# Altium project Data Receiver.PrjPcb
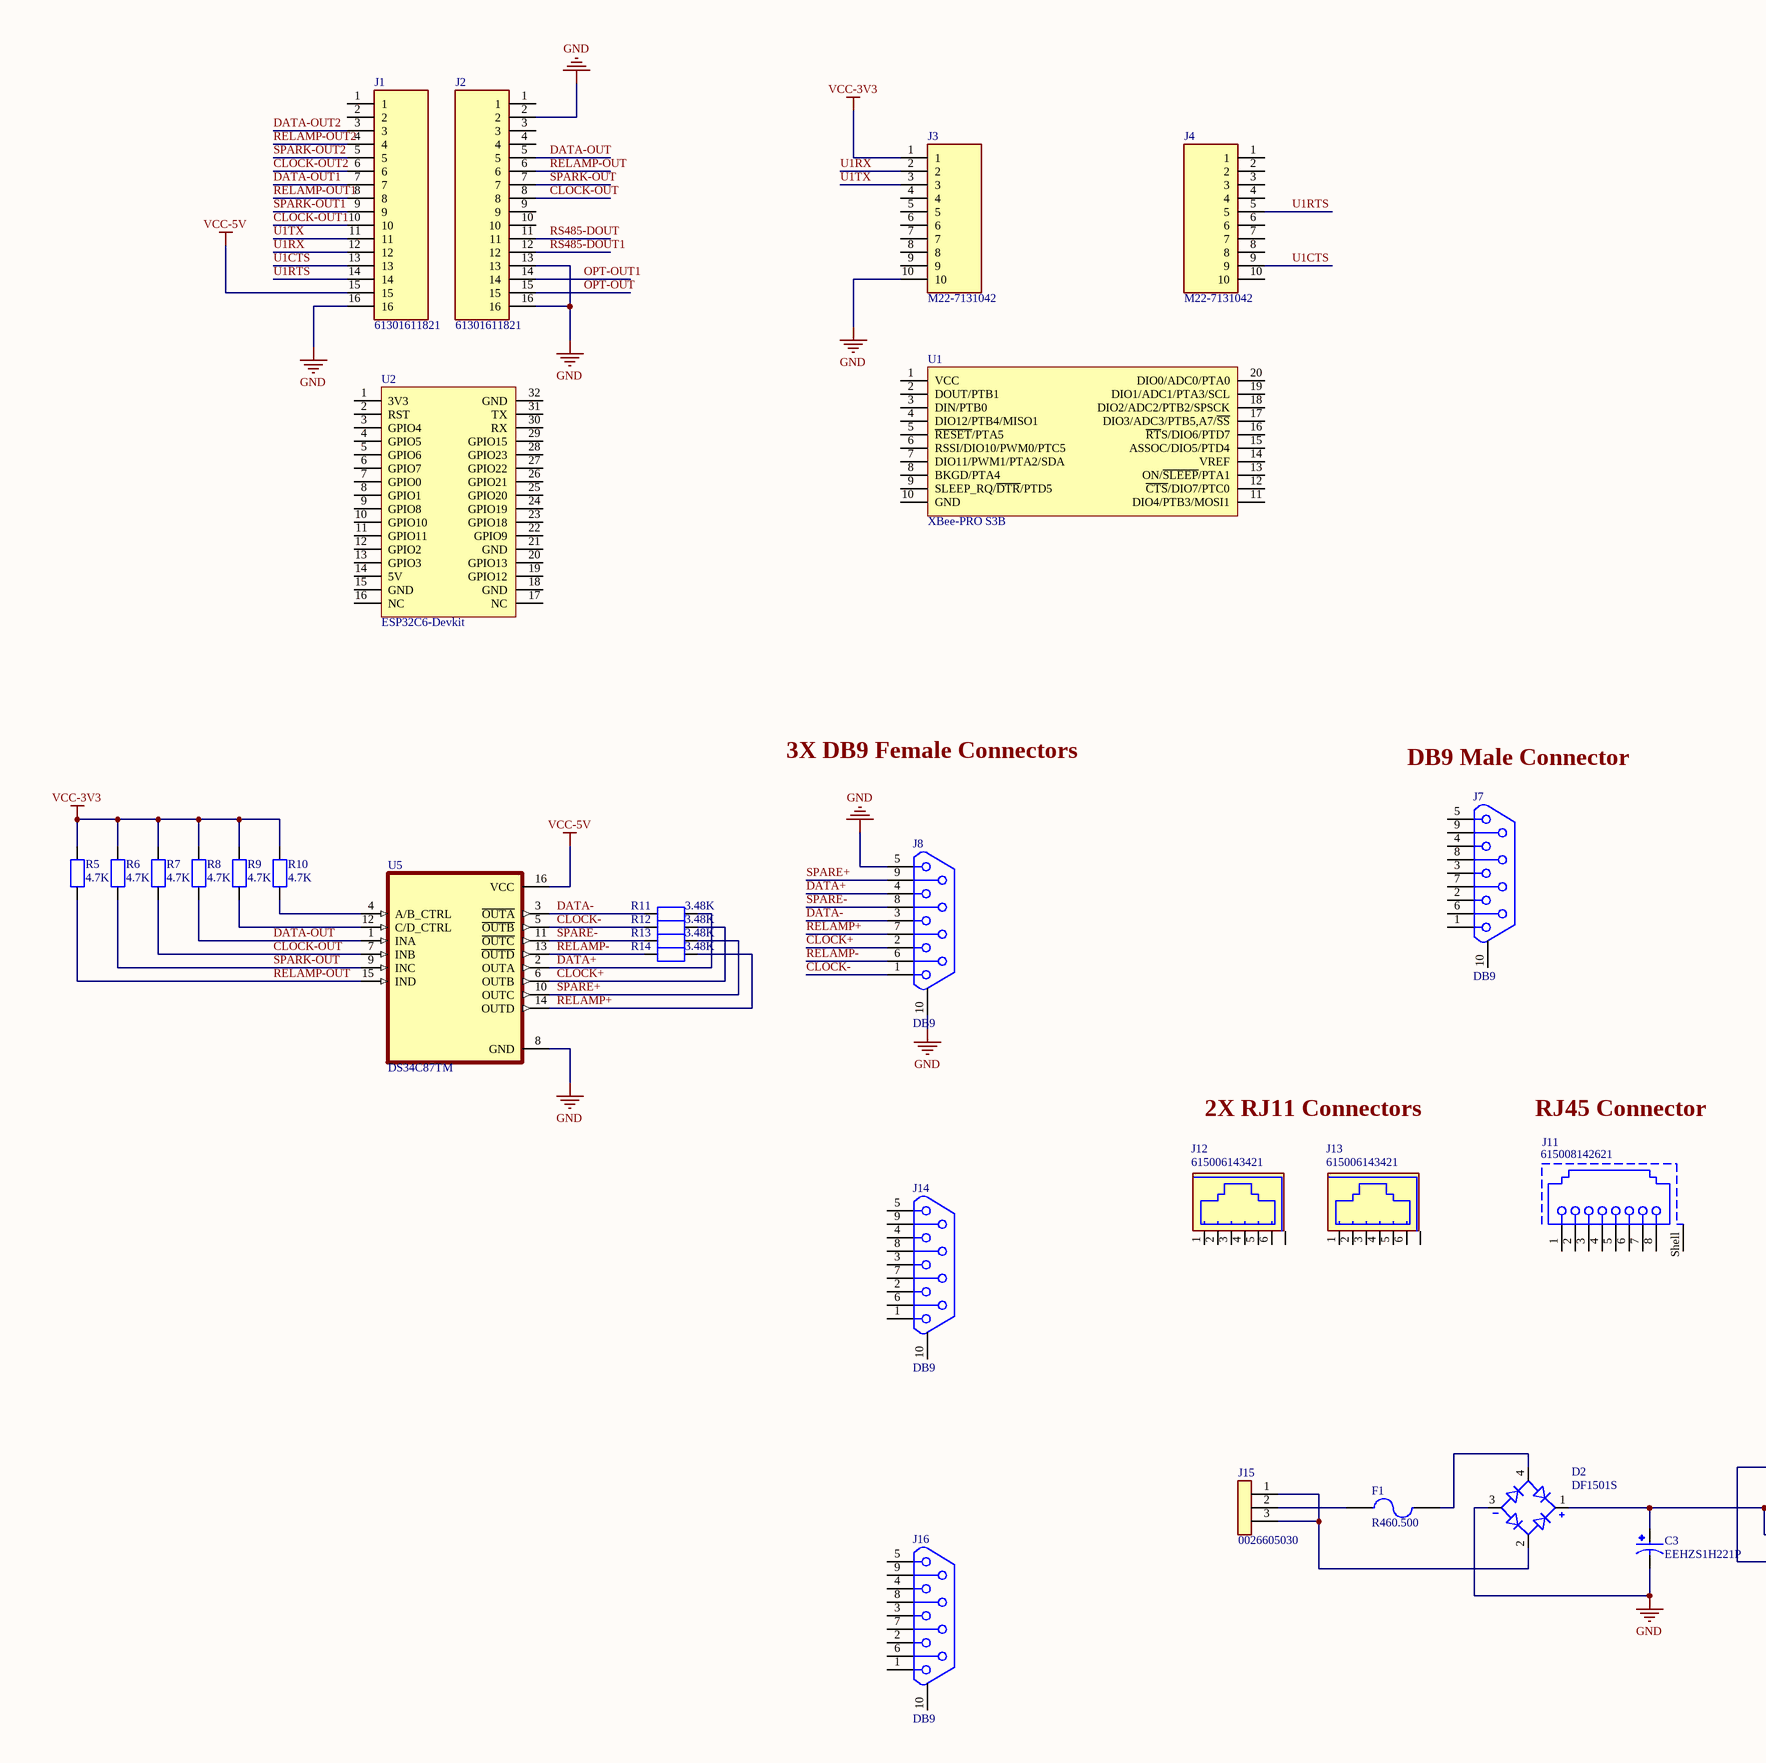
[diagram p0: Data Receiver.SchDoc, left]
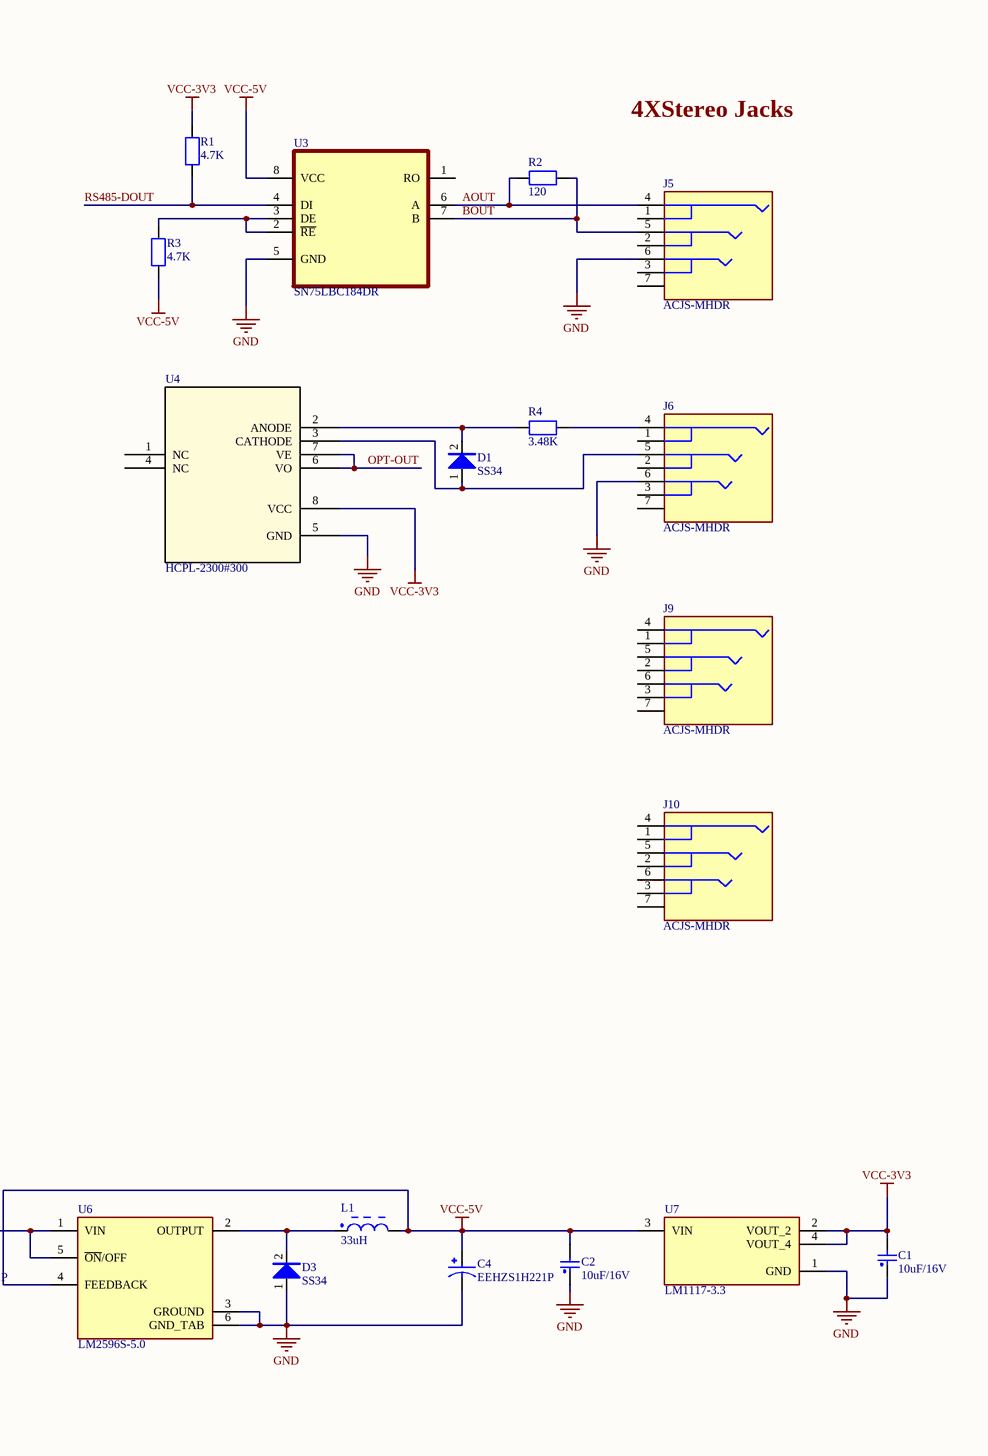
[diagram p1: Data Receiver.SchDoc, right]
1 sheet, 46 parts. Net scope: global (net labels, ports and power ports of the same name join across sheets).
Board file: Data Receiver.PcbDoc

## Sheet Data Receiver.SchDoc
size A2; SheetNumber: 1; SheetTotal: 1

### Parts
C1  10uF/16V  [CAP-0805]
C2  10uF/16V  [CAP-0805]
C3  EEHZS1H221P  [CAP_EEHZS1H221P]
C4  EEHZS1H221P  [CAP_EEHZS1H221P]
D1  SS34  [SMA]
D2  DF1501S  [SOT520P1040X293-4N]
D3  SS34  [SMA]
F1  R460.500  [CAPM7243X30N]
J1  61301611821  [61301611821]
J2  61301611821  [61301611821]
J3  M22-7131042  [M22-7131042]
J4  M22-7131042  [M22-7131042]
J5  ACJS-MHDR  [ACJSMHDR]
J6  ACJS-MHDR  [ACJSMHDR]
J7  DB9  [DB9/F_A]
J8  DB9  [DB9/S_A]
J9  ACJS-MHDR  [ACJSMHDR]
J10  ACJS-MHDR  [ACJSMHDR]
J11  615008142621  [615008142621]
J12  615006143421  [615006143421]
J13  615006143421  [615006143421]
J14  DB9  [DB9/S_A]
J15  0026605030  [0026605030]
J16  DB9  [DB9/S_A]
L1  33uH  [IND_BOURNS_SRR12]
R1  4.7K  [R0603]
R2  120  [R0603]
R3  4.7K  [R0603]
R4  3.48K  [R0603]
R5  4.7K  [R0603]
R6  4.7K  [R0603]
R7  4.7K  [R0603]
R8  4.7K  [R0603]
R9  4.7K  [R0603]
R10  4.7K  [R0603]
R11  3.48K  [R0603]
R12  3.48K  [R0603]
R13  3.48K  [R0603]
R14  3.48K  [R0603]
U1  XBee-PRO S3B  [XBEE(MMS-110-02-L-SV-K-TR)]
U2  ESP32C6-Devkit  [ESP32-C6-Devkit]
U3  SN75LBC184DR  [SOIC127P620X175-8N]
U4  HCPL-2300#300  [SOP254P960X420-8N]
U5  DS34C87TM  [SOIC127P600X175-16N]
U6  LM2596S-5.0  [TO170P1524X483-6N]
U7  LM1117-3.3  [VREG_LM1117MPX-3.3]

### Nets
GND: C1.1 C2.1 C3.2 C4.2 D2.3(NEG) D3.1 J1.16 J2.2 J2.13 J2.16 J3.10 J5.6 J6.6 J8.5 J8.10 U3.5(GND) U4.5(GND) U5.8(GND) U6.3(GROUND) U6.6(GND_TAB) U7.1(GND)
VCC-3V3: C1.2 J3.1 R1.2 R5.2 R6.2 R7.2 R8.2 R9.2 R10.2 U4.8(VCC) U7.2(VOUT_2) U7.4(VOUT_4)
VCC-5V: C2.2 C4.1 J1.15 L1.2 R3.1 U3.8(VCC) U5.16(VCC) U6.4(FEEDBACK) U7.3(VIN)
AOUT: J5.4 R2.2 U3.6(A)
BOUT: J5.5 R2.1 U3.7(B)
CLOCK+: J8.2 R12.2 U5.6(OUTB)
CLOCK-: J8.1 R12.1 U5.5(~{OUTB})
CLOCK-OUT: J2.8 R7.1 U5.7(INB)
CLOCK-OUT1: J1.10
CLOCK-OUT2: J1.6
DATA+: J8.4 R11.2 U5.2(OUTA)
DATA-: J8.3 R11.1 U5.3(~{OUTA})
DATA-OUT: J2.5 R8.1 U5.1(INA)
DATA-OUT1: J1.7
DATA-OUT2: J1.3
OPT-OUT: J2.15 U4.6(VO) U4.7(VE)
OPT-OUT1: J2.14
RELAMP+: J8.7 R14.2 U5.14(OUTD)
RELAMP-: J8.6 R14.1 U5.13(~{OUTD})
RELAMP-OUT: J2.6 R5.1 U5.15(IND)
RELAMP-OUT1: J1.8
RELAMP-OUT2: J1.4
RS485-DOUT: J2.11 R1.1 U3.4(DI)
RS485-DOUT1: J2.12
SPARE+: J8.9 R13.2 U5.10(OUTC)
SPARE-: J8.8 R13.1 U5.11(~{OUTC})
SPARK-OUT: J2.7 R6.1 U5.9(INC)
SPARK-OUT1: J1.9
SPARK-OUT2: J1.5
U1CTS: J1.13 J4.9
U1RTS: J1.14 J4.5
U1RX: J1.12 J3.2
U1TX: J1.11 J3.3
NetC3_1: C3.1 D2.1(POS) U6.1(VIN) U6.5(~{ON}/OFF)
NetD1_1: D1.1 J6.5 U4.3(CATHODE)
NetD1_2: D1.2 R4.1 U4.2(ANODE)
NetD2_2: D2.2(AC1) J15.1 J15.3
NetD2_4: D2.4(AC2) F1.2
NetD3_2: D3.2 L1.1 U6.2(OUTPUT)
NetF1_1: F1.1 J15.2
NetJ6_4: J6.4 R4.2
NetJ12_S1: J12.S1(SHIELD) J12.S2(SHIELD)
NetJ13_S1: J13.S1(SHIELD) J13.S2(SHIELD)
NetR3_2: R3.2 U3.2(~{RE}) U3.3(DE)
NetR9_1: R9.1 U5.12(C/D_CTRL)
NetR10_1: R10.1 U5.4(A/B_CTRL)

Not connected (* = marked no-connect by the designer): J1 1 2; J2 1 3 4 9 10; J3 4 5 6 7 8 9; J4 1 2 3 4 6 7 8 10; J5 1 2 3 7; J6 1 2 3 7; J7 1 2 3 4 5 6 7 8 9 10; J9 1 2 3 4 5 6 7; J10 1 2 3 4 5 6 7; J11 1 2 3 4 5 6 7 8 Shell; J12 1(6) 2(5) 3(4) 4(3) 5(2) 6(1); J13 1(6) 2(5) 3(4) 4(3) 5(2) 6(1); J14 1 2 3 4 5 6 7 8 9 10; J16 1 2 3 4 5 6 7 8 9 10; U1 1(VCC) 2(DOUT/PTB1) 3(DIN/PTB0) 4(DIO12/PTB4/MISO1) 5(~{RESET}/PTA5) 6(RSSI/DIO10/PWM0/PTC5) 7(DIO11/PWM1/PTA2/SDA) 8(BKGD/PTA4) 9(SLEEP_RQ/~{DTR}/PTD5) 10(GND) 11(DIO4/PTB3/MOSI1) 12(~{CTS}/DIO7/PTC0) 13(ON/~{SLEEP}/PTA1) 14(VREF) 15(ASSOC/DIO5/PTD4) 16(~{RT}S/DIO6/PTD7) 17(DIO3/ADC3/PTB5,A7/~{SS}) 18(DIO2/ADC2/PTB2/SPSCK) 19(DIO1/ADC1/PTA3/SCL) 20(DIO0/ADC0/PTA0); U2 1(3V3) 2(RST) 3(GPIO4) 4(GPIO5) 5(GPIO6) 6(GPIO7) 7(GPIO0) 8(GPIO1) 9(GPIO8) 10(GPIO10) 11(GPIO11) 12(GPIO2) 13(GPIO3) 14(5V) 15(GND) 16(NC) 17(NC) 18(GND) 19(GPIO12) 20(GPIO13) 21(GND) 22(GPIO9) 23(GPIO18) 24(GPIO19) 25(GPIO20) 26(GPIO21) 27(GPIO22) 28(GPIO23) 29(GPIO15) 30(RX) 31(TX) 32(GND); U3 1(RO); U4 1(NC) 4(NC)

### Notes on the sheet
- 4XStereo Jacks
- 3X DB9 Female Connectors
- (near J7) DB9 Male Connector
- 2X RJ11 Connectors
- RJ45 Connector

### Library data of the parts
C1 C2 = CAP: Capacitor; Manufacturer: Samsung Electro-Mechanics; Manufacturer Part Number: CL10B104KO8NNNC; Value: 16V/0.1uF; Package: 0603; Supplier Part Number: 1276-1005-1-ND; Supplier: Digi-key
C3 C4 = EEHZS1H221P: Aluminium Organic Polymer Capacitors 50VDC 220uF 125degC Hybrid Cap AEC-Q200; Manufacturer: Panasonic; Value: EEH-ZS1H221P; Price: 2.36; Supplier: Digi-key; Manufacturer Part Number: EEH-ZS1H221P; Supplier Part Number: P124104TR-ND
D1 D3 = DIODE: Diode 40 V 3A Surface Mount SMA; Manufacturer: Taiwan Semiconductor; Value: SS34; Supplier Part Number: SS34FSTR-ND; Price: 0.56; Manufacturer Part Number: SS34; Supplier: Digi-key
D2 = DF1501S: Bridge Rectifier Single Phase Standard 100V Surface Mount DFS; Manufacturer: Diodes Incorporated; Price: 0.87; Value: DF1501S; Manufacturer Part Number: DF1501S; Supplier: Digi-key; Supplier Part Number: DF1501SDI-ND
F1 = Fuse 2: 500 mA 125 V AC 125 V DC Fuse Board Mount (Cartridge Style Excluded) Surface Mount 2-SMD, J-Lead; Manufacturer: Littelfuse Inc.; Manufacturer Part Number: 0460.500ER; Supplier: Digi-key; Supplier Part Number: 0460.500ER-ND; Price: 1.3; Value: 500 mA 125 V AC 125 V DC
J1 J2 = 61301611821: 16 Position Header Connector 0.100" (2.54mm) Through Hole Gold; Manufacturer: Wurth Elektronik; Geometry.Height: 8.65mm; Value: 1Row 16Pin; Supplier Part Number: 61301611821-ND; Supplier: Digi-key; Manufacturer Part Number: 61301611821; Price: 0.68
J3 J4 = M22-7131042: 2.00mm (0.079") Pitch SIL Vertical 2.6mm Throughboard Socket Assembly, selective gold + tin, 10 contacts; Manufacturer: Harwin; Geometry.Height: 4.4mm; Supplier Part Number: 952-1354-5-ND; Supplier: Digi-key; Manufacturer Part Number: M22-7131042; Price: 1.9; Value: M22-7131042
J5 J6 J9 J10 = ACJS-MHDR: Phone Connectors 1/4" STEREO SWITCHED REAN; Manufacturer: Amphenol Audio; Price: 1.68; Value: ACJS-MHDR; Manufacturer Part Number: ACJS-MHDR; Supplier: Digi-key; Supplier Part Number: 889-1817-ND
J7 = DB9_Male: 9 Position D-Sub Receptacle, Male Sockets Connector; Manufacturer: Würth Elektronik; Manufacturer Part Number: 618009231321; Value: 618009231321; Supplier: Digi-key; Supplier Part Number: 732-618009231321-ND; Price: 3.57
J8 J14 J16 = DB9: 9 Position D-Sub Receptacle, Female Sockets Connector; Manufacturer: Würth Elektronik; Manufacturer Part Number: 618009231321; Value: 618009231321; Supplier: Digi-key; Supplier Part Number: 732-618009231321-ND; Price: 3.57
J11 = 615008142621: WR-MJ Modular Jack THT Horizontal Shielded Rear Grounding Post 8P8C Tab Down; Manufacturer: Wurth Elektronik; Contact Resistance: 20mΩ; Insulation Resistance: 500MΩ; LED: No; Number of Ports: 1; Rated Current: 1.5A; Shielding: Yes; Working Voltage: 120VAC; Withstanding Voltage: 1000VAC; ComponentLink1Description: Website Link; ComponentLink1URL: https://www.we-online.com/redexpert/article/615008142621?ad; ComponentLink2Description: Datasheet Link; ComponentLink2URL: https://www.we-online.com/redexpert/spec/615008142621?ad; Manufacturer Part Number: 615008142621; Category: Input/Output Connectors; Match Code: WR-MJ; Mount: Through Hole; Operating Temperature Max: 85°C; Operating Temperature Min: -40°C; Packaging: Tray; Number of Pins: 8P8C; Orientation: Horizontal; Supplier: Digi-key; Supplier Part Number: 732-3163-ND; Price: 2.7; Value: 615008142621
J12 J13 = 615006143421: Modular Connectors / Ethernet Connectors WR-COM Modular Jack Horztl 1.5A; Manufacturer: Wurth Elektronik; Supplier Part Number: 732-615006143421-ND; Supplier: Digi-key; Value: 615006143421; Manufacturer Part Number: 615006143421; Price: 2.7
J15 = HEADER3: Connector Header Through Hole, Right Angle 3 position 0.156" (3.96mm); Manufacturer: Molex; Value: 3pin connector; Manufacturer Part Number: 0026605030; Supplier: Digi-key; Supplier Part Number: WM4641-ND; Price: 0.45
L1 = INDUCTOR: 33 µH Shielded Drum Core, Wirewound Inductor 3.5 A 57mOhm Max Nonstandard; Manufacturer: Bourns Inc.; Manufacturer Part Number: SRR1280-330M; Value: 33uH, 3.5A; Supplier Part Number: SRR1280-330MCT-ND; Price: 1.18; Supplier: Digi-key
R1 R3 R5-R10 = 4.7K Ohms ±1% 0.1W: 4.7 kOhms ±1% 0.1W, 1/10W Chip Resistor 0603 (1608 Metric) Moisture Resistant Thick Film; Manufacturer: Yageo; Manufacturer Part Number: RC0603FR-074K7L; Value: 4.7K; Supplier: Digi-key; Supplier Part Number: 311-4.70KHRTR-ND; Price: 0.1
R2 = 120 Ohms ±1% 0.1W: 120 Ohms ±1% 0.1W, 1/10W Chip Resistor 0603 (1608 Metric) Moisture Resistant Thick Film; Manufacturer: Yageo; Manufacturer Part Number: RC0603FR-07120RL; Value: 120; Supplier: Digi-key; Supplier Part Number: 311-120HRTR-ND; Price: 0.1
R4 R11-R14 = 3.48K Ohms ±1% 0.1W: 3.48 kOhms ±1% 0.1W, 1/10W Chip Resistor 0603 (1608 Metric) Moisture Resistant Thick Film; Manufacturer: Yageo; Manufacturer Part Number: RC0603FR-073K48L; Value: 3.48K; Supplier: Digi-key; Supplier Part Number: 311-3.48KHRTR-ND; Price: 0.1
U1 = XBee-PRO S3B: General ISM < 1GHz Transceiver Module 920MHz Antenna Not Included, RP-SMA Through Hole; Manufacturer: DIGI; Manufacturer Part Number: XBP9B-XCST-022; Value: No-FIT; Supplier Part Number: 602-1353-ND; Supplier: Digi-key; Price: 58.5
U2 = ESP32C6-Devkit: ESP32-C6-MINI-1 Transceiver; Bluetooth® 5 2.4GHz Evaluation Board; Manufacturer: Espressif Systems; Manufacturer Part Number: ESP32-C6-DevKitM-1-N4; Value: No FIT; Supplier Part Number: 1965-ESP32-C6-DEVKITM-1-N4-ND; Supplier: Digi-key; Price: 8
U3 = SP485EEN-L: Enhanced Low Power Half-Duplex RS-485 Transceivers; Manufacturer: MaxLinear, Inc.; Price: 1; Value: SP485EEN-L; Manufacturer Part Number: SP485EEN-L; Supplier: Digi-key; Supplier Part Number: 1016-1171-5-ND
U4 = HCPL-2300#300: Logic Output Optoisolator 5MBd Open Collector, Schottky Clamped 3750Vrms 1 Channel 100V/µs CMTI 8-DIP Gull Wing; Manufacturer: Broadcom Limited; Manufacturer Part Number: HCPL-2300#300; Supplier: Digi-key; Supplier Part Number: 516-1069-5-ND; Price: 5; Value: HCPL-2300#300
U5 = DS34C87TM: 4/0 Driver RS422, RS485 16-SOIC; Manufacturer: Texas Instruments; Value: DS34C87TM/NOPB; Price: 1.93; Supplier Part Number: DS34C87TM/NOPB-ND; Manufacturer Part Number: DS34C87TM/NOPB; Supplier: Digi-key
U6 = LM2596S-5.0: IC REG BUCK 5V 3A TO263-5; Manufacturer: Texas Instruments; Price: 9; Value: LM2596S-5.0; Manufacturer Part Number: LM2596S-5.0; Supplier: Digi-key; Supplier Part Number: LM2596S-5.0-ND
U7 = LM1117MPX-3.3: 800-mA 15-V linear voltage regulator 4-SOT-223 0 to 125; Manufacturer: National Semiconductor; Price: 2; Value: LM1117MPX-3.3; Manufacturer Part Number: LM1117MPX-3.3; Supplier: Digi-key; Supplier Part Number: 2156-LM1117MPX-3.3-14-ND